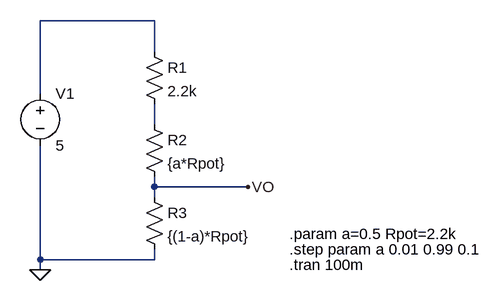
[diagram p0: schematic resistor_divider.asc]
resistor_divider.asc, the LTspice schematic file:
Version 4
SHEET 1 880 680
WIRE 128 112 -48 112
WIRE 128 160 128 112
WIRE -48 224 -48 112
WIRE 128 272 128 240
WIRE 128 368 128 352
WIRE 272 368 128 368
WIRE 128 384 128 368
WIRE -48 480 -48 304
WIRE 128 480 128 464
WIRE 128 480 -48 480
WIRE -48 496 -48 480
FLAG -48 496 0
FLAG 272 368 VO
SYMBOL Voltage -48 208 R0
SYMATTR InstName V1
SYMATTR Value 5
SYMBOL Res 112 144 R0
SYMATTR InstName R1
SYMATTR Value 2.2k
SYMBOL Res 112 256 R0
SYMATTR InstName R2
SYMATTR Value {a*Rpot}
SYMBOL Res 112 368 R0
SYMATTR InstName R3
SYMATTR Value {(1-a)*Rpot}
TEXT 336 488 Left 2 !.tran 100m
TEXT 336 464 Left 2 !.step param a 0.01 0.99 0.1
TEXT 336 440 Left 2 !.param a=0.5 Rpot=2.2k

The netlist it stands for:
* resistor_divider.asc
V1 N001 0 5
R1 N001 N002 2.2k
R2 N002 VO {a*Rpot}
R3 VO 0 {(1-a)*Rpot}
.tran 100m
.step param a 0.01 0.99 0.1
.param a=0.5 Rpot=2.2k
.backanno
.end